# EAGLE design Audio panel board (EAGLE 9.6.2)
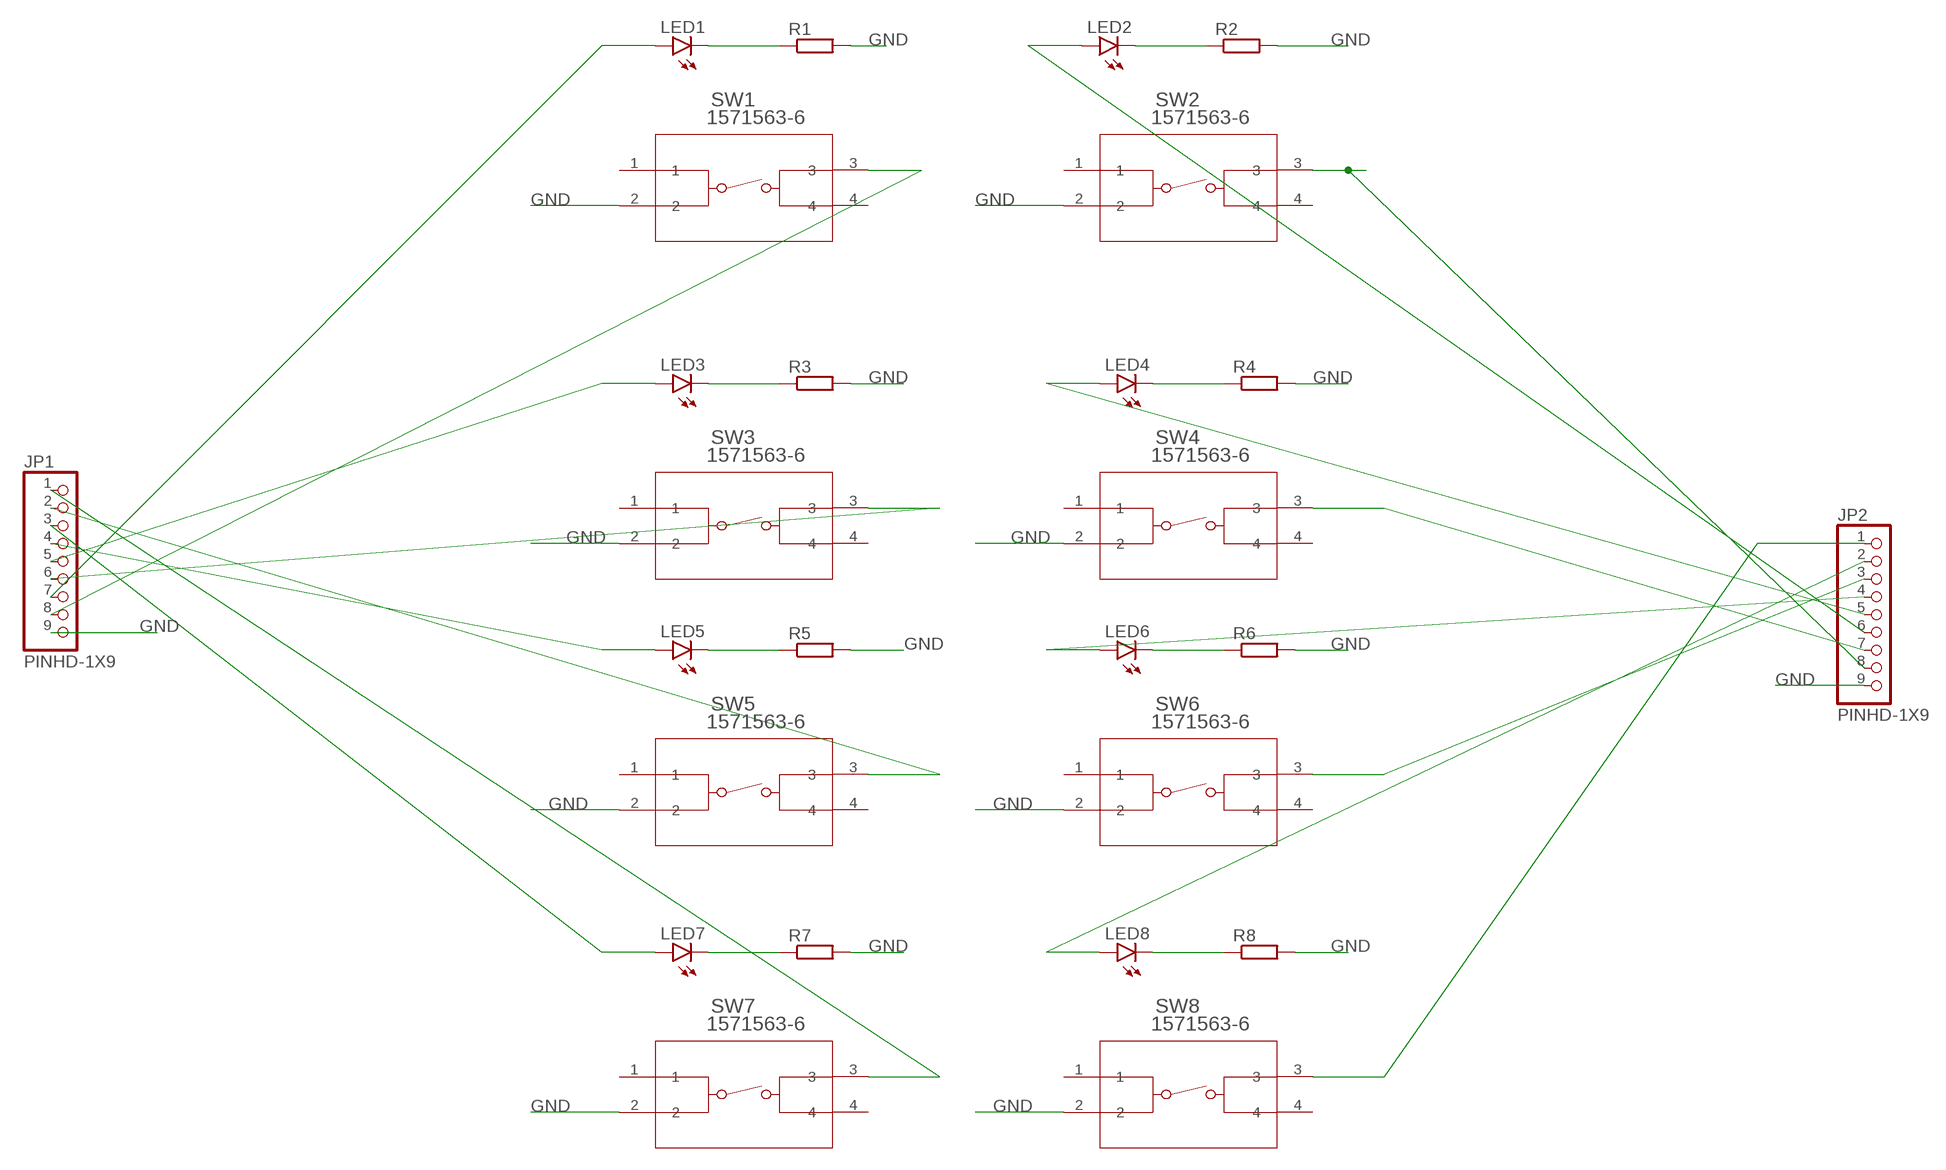
[diagram p0: schematic, sheet 1, part 1 of 2]
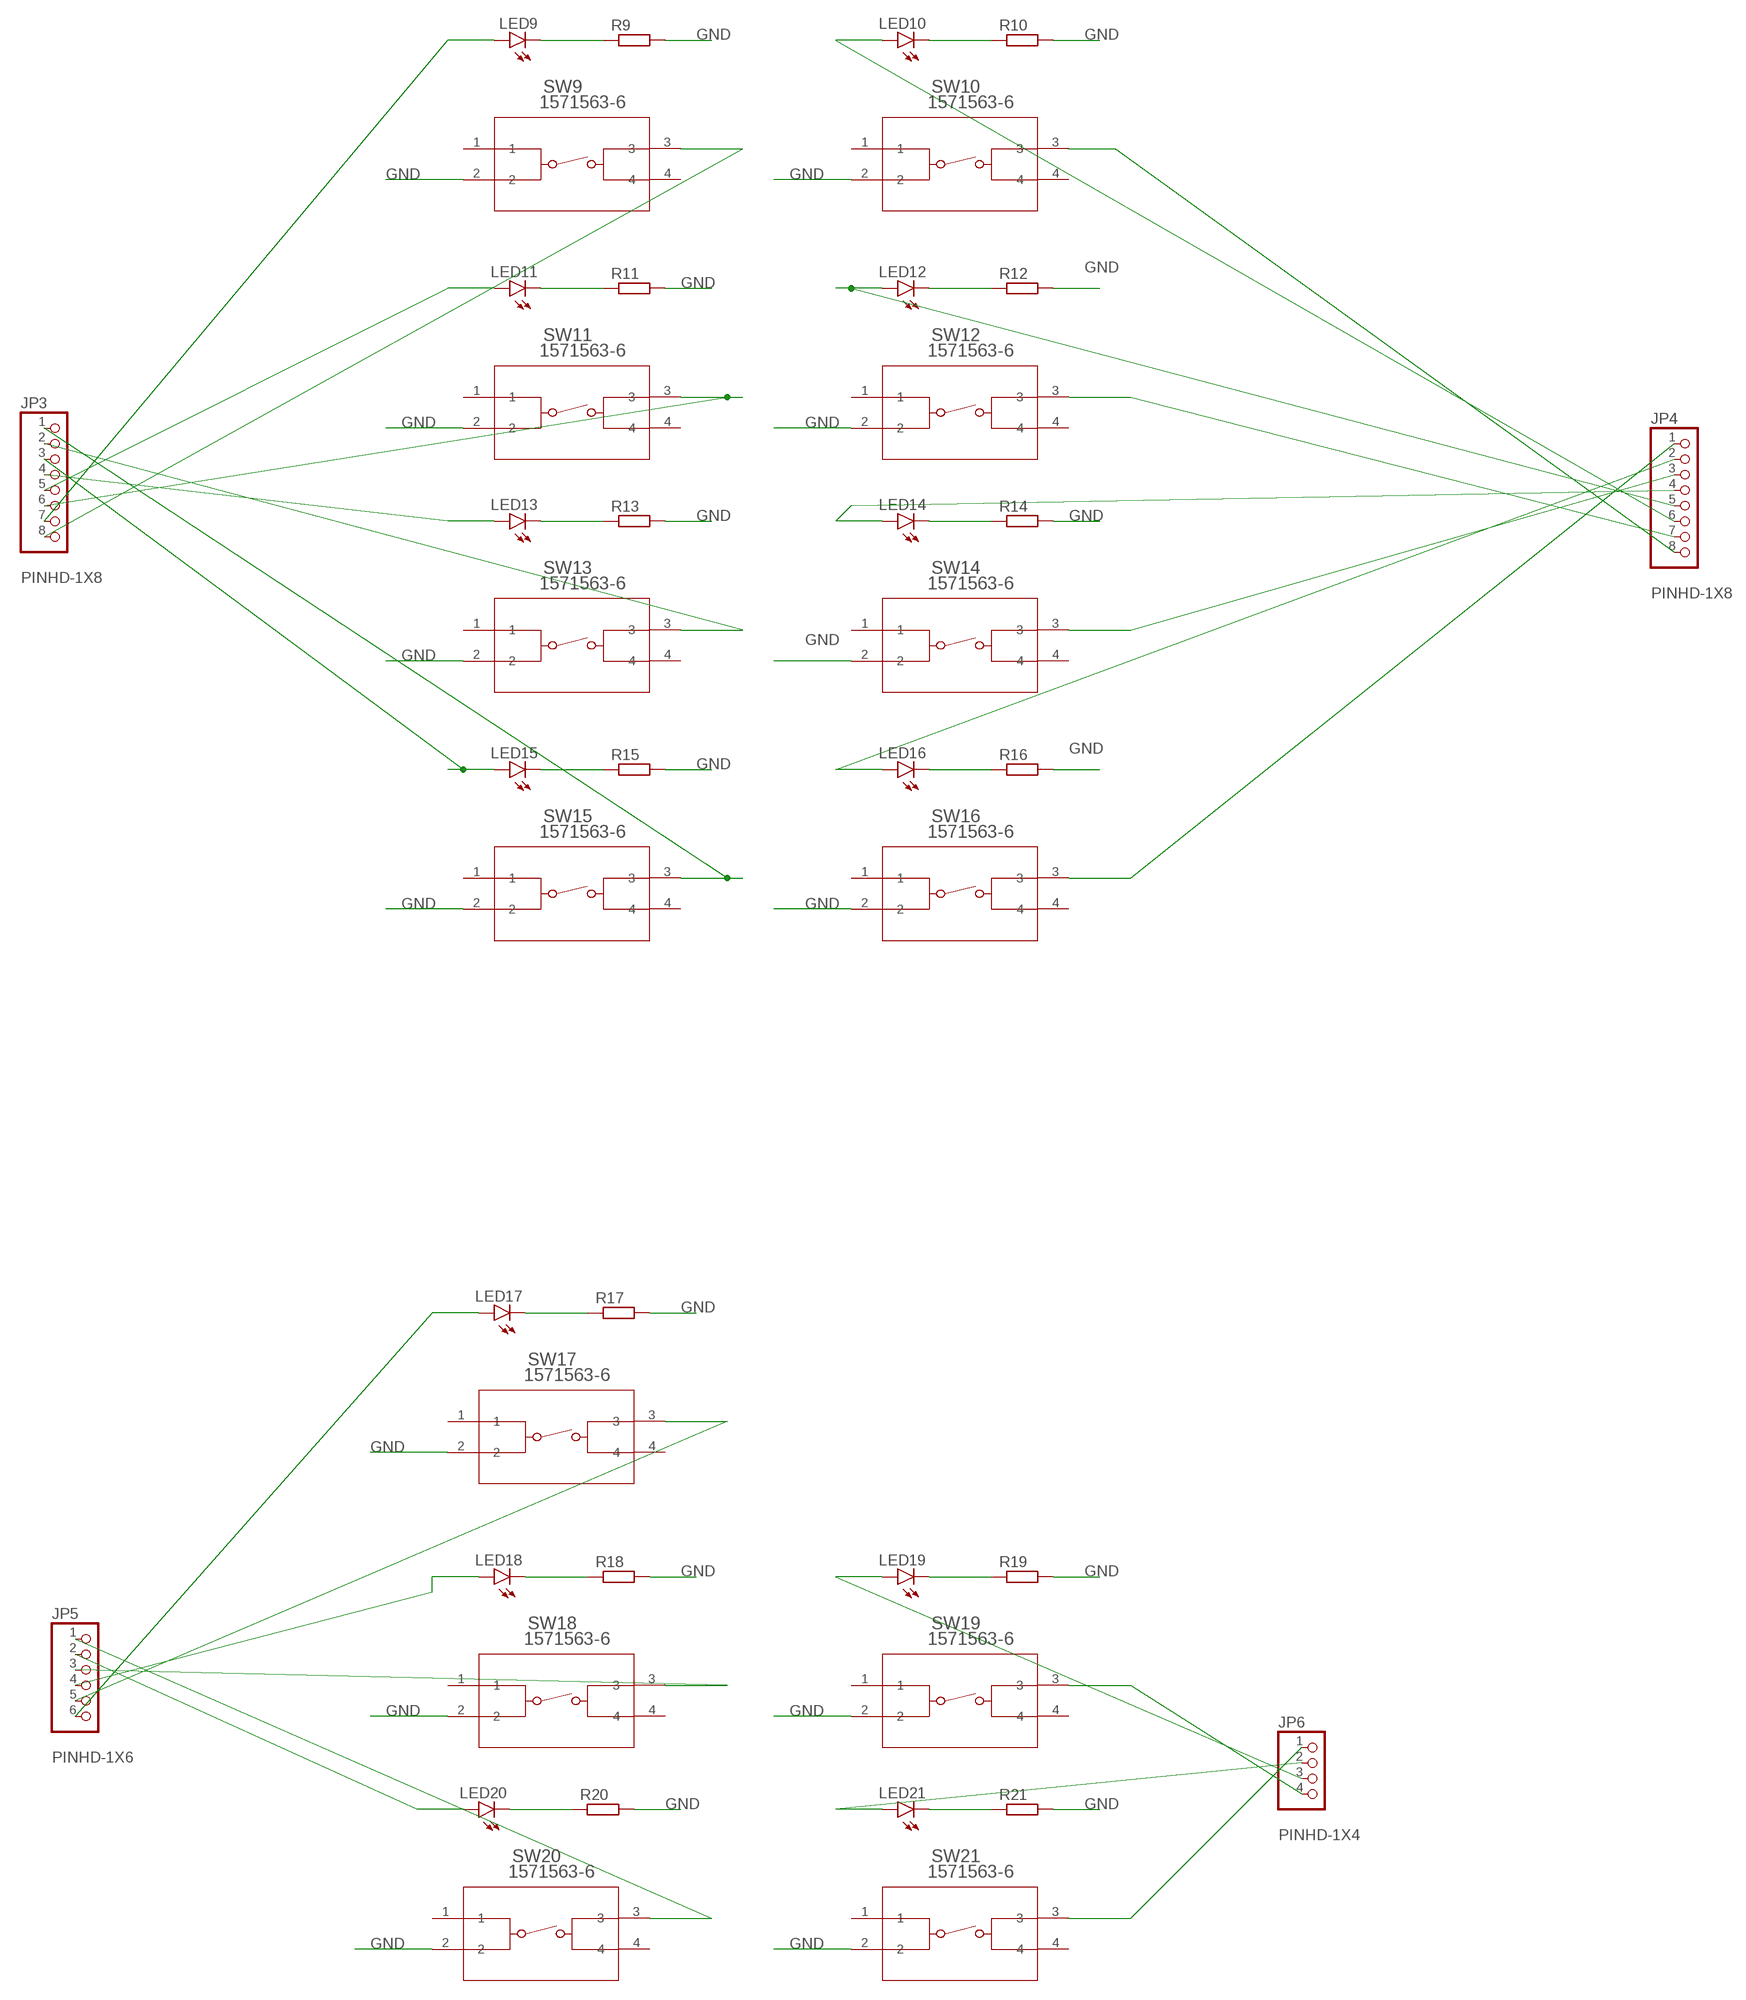
[diagram p1: schematic, sheet 1, part 2 of 2]

## Parts
JP1  PINHD-1X9  [1X09]
JP2  PINHD-1X9  [1X09]
JP3  PINHD-1X8  [1X08]
JP4  PINHD-1X8  [1X08]
JP5  PINHD-1X6  [1X06]
JP6  PINHD-1X4  [1X04]
LED1  LEDCHIP-LED0805  [CHIP-LED0805]
LED2  LEDCHIP-LED0805  [CHIP-LED0805]
LED3  LEDCHIP-LED0805  [CHIP-LED0805]
LED4  LEDCHIP-LED0805  [CHIP-LED0805]
LED5  LEDCHIP-LED0805  [CHIP-LED0805]
LED6  LEDCHIP-LED0805  [CHIP-LED0805]
LED7  LEDCHIP-LED0805  [CHIP-LED0805]
LED8  LEDCHIP-LED0805  [CHIP-LED0805]
LED9  LEDCHIP-LED0805  [CHIP-LED0805]
LED10  LEDCHIP-LED0805  [CHIP-LED0805]
LED11  LEDCHIP-LED0805  [CHIP-LED0805]
LED12  LEDCHIP-LED0805  [CHIP-LED0805]
LED13  LEDCHIP-LED0805  [CHIP-LED0805]
LED14  LEDCHIP-LED0805  [CHIP-LED0805]
LED15  LEDCHIP-LED0805  [CHIP-LED0805]
LED16  LEDCHIP-LED0805  [CHIP-LED0805]
LED17  LEDCHIP-LED0805  [CHIP-LED0805]
LED18  LEDCHIP-LED0805  [CHIP-LED0805]
LED19  LEDCHIP-LED0805  [CHIP-LED0805]
LED20  LEDCHIP-LED0805  [CHIP-LED0805]
LED21  LEDCHIP-LED0805  [CHIP-LED0805]
R1  R-EU_R1206  [R1206]
R2  R-EU_R1206  [R1206]
R3  R-EU_R1206  [R1206]
R4  R-EU_R1206  [R1206]
R5  R-EU_R1206  [R1206]
R6  R-EU_R1206  [R1206]
R7  R-EU_R1206  [R1206]
R8  R-EU_R1206  [R1206]
R9  R-EU_R1206  [R1206]
R10  R-EU_R1206  [R1206]
R11  R-EU_R1206  [R1206]
R12  R-EU_R1206  [R1206]
R13  R-EU_R1206  [R1206]
R14  R-EU_R1206  [R1206]
R15  R-EU_R1206  [R1206]
R16  R-EU_R1206  [R1206]
R17  R-EU_R1206  [R1206]
R18  R-EU_R1206  [R1206]
R19  R-EU_R1206  [R1206]
R20  R-EU_R1206  [R1206]
R21  R-EU_R1206  [R1206]
SW1  1571563-6  [SW4_1437565-E]
SW2  1571563-6  [SW4_1437565-E]
SW3  1571563-6  [SW4_1437565-E]
SW4  1571563-6  [SW4_1437565-E]
SW5  1571563-6  [SW4_1437565-E]
SW6  1571563-6  [SW4_1437565-E]
SW7  1571563-6  [SW4_1437565-E]
SW8  1571563-6  [SW4_1437565-E]
SW9  1571563-6  [SW4_1437565-E]
SW10  1571563-6  [SW4_1437565-E]
SW11  1571563-6  [SW4_1437565-E]
SW12  1571563-6  [SW4_1437565-E]
SW13  1571563-6  [SW4_1437565-E]
SW14  1571563-6  [SW4_1437565-E]
SW15  1571563-6  [SW4_1437565-E]
SW16  1571563-6  [SW4_1437565-E]
SW17  1571563-6  [SW4_1437565-E]
SW18  1571563-6  [SW4_1437565-E]
SW19  1571563-6  [SW4_1437565-E]
SW20  1571563-6  [SW4_1437565-E]
SW21  1571563-6  [SW4_1437565-E]

## Nets
GND: JP1.9 JP2.9 R1.2 R2.2 R3.2 R4.2 R5.2 R6.2 R7.2 R8.2 R9.2 R10.2 R11.2 R12.2 R13.2 R14.2 R15.2 R16.2 R17.2 R18.2 R19.2 R20.2 R21.2 SW1.2 SW2.2 SW3.2 SW4.2 SW5.2 SW6.2 SW7.2 SW8.2 SW9.2 SW10.2 SW11.2 SW12.2 SW13.2 SW14.2 SW15.2 SW16.2 SW17.2 SW18.2 SW19.2 SW20.2 SW21.2
N$1: JP2.1 SW8.3
N$2: JP4.8 SW10.3
N$3: JP5.4 LED18.A
N$4: LED1.C R1.1
N$5: LED2.C R2.1
N$6: LED3.C R3.1
N$10: JP1.7 LED1.A
N$11: JP1.5 LED3.A
N$12: JP2.6 LED2.A
N$13: JP2.8 SW2.3
N$14: JP1.8 SW1.3
N$15: JP1.6 SW3.3
N$17: LED4.C R4.1
N$19: JP2.5 LED4.A
N$20: JP2.7 SW4.3
N$22: LED5.C R5.1
N$24: JP1.4 LED5.A
N$25: JP1.2 SW5.3
N$27: LED6.C R6.1
N$29: JP2.4 LED6.A
N$30: JP2.3 SW6.3
N$32: LED7.C R7.1
N$34: JP1.3 LED7.A
N$35: JP1.1 SW7.3
N$37: LED8.C R8.1
N$39: JP2.2 LED8.A
N$42: LED9.C R9.1
N$44: JP3.7 LED9.A
N$45: JP3.8 SW9.3
N$47: LED10.C R10.1
N$49: JP4.6 LED10.A
N$52: LED11.C R11.1
N$54: JP3.5 LED11.A
N$55: JP3.6 SW11.3
N$57: LED12.C R12.1
N$59: JP4.5 LED12.A
N$60: JP4.7 SW12.3
N$62: LED13.C R13.1
N$64: JP3.4 LED13.A
N$65: JP3.2 SW13.3
N$67: LED14.C R14.1
N$69: JP4.4 LED14.A
N$70: JP4.3 SW14.3
N$72: LED15.C R15.1
N$74: JP3.3 LED15.A
N$75: JP3.1 SW15.3
N$77: LED16.C R16.1
N$79: JP4.2 LED16.A
N$80: JP4.1 SW16.3
N$82: LED17.C R17.1
N$84: JP5.6 LED17.A
N$85: JP5.5 SW17.3
N$87: LED18.C R18.1
N$90: JP5.3 SW18.3
N$92: LED19.C R19.1
N$94: JP6.3 LED19.A
N$95: JP6.4 SW19.3
N$97: LED20.C R20.1
N$99: JP5.2 LED20.A
N$100: JP5.1 SW20.3
N$102: LED21.C R21.1
N$104: JP6.2 LED21.A
N$105: JP6.1 SW21.3
Unconnected: SW1.1 SW1.4 SW2.1 SW2.4 SW3.1 SW3.4 SW4.1 SW4.4 SW5.1 SW5.4 SW6.1 SW6.4 SW7.1 SW7.4 SW8.1 SW8.4 SW9.1 SW9.4 SW10.1 SW10.4 SW11.1 SW11.4 SW12.1 SW12.4 SW13.1 SW13.4 SW14.1 SW14.4 SW15.1 SW15.4 SW16.1 SW16.4 SW17.1 SW17.4 SW18.1 SW18.4 SW19.1 SW19.4 SW20.1 SW20.4 SW21.1 SW21.4

## Library data of the parts
JP1 JP2 = Connector:PINHD-1X9: PIN HEADER; CATEGORY: CONNECTOR; SUB-CATEGORY: PIN-HEADER
JP3 JP4 = Connector:PINHD-1X8: PIN HEADER; CATEGORY: CONNECTOR; SUB-CATEGORY: PIN-HEADER
JP5 = Connector:PINHD-1X6: PIN HEADER; CATEGORY: CONNECTOR; SUB-CATEGORY: PIN-HEADER
JP6 = Connector:PINHD-1X4: PIN HEADER; CATEGORY: CONNECTOR; SUB-CATEGORY: PIN-HEADER
LED1-LED21 = led:LED: LED OSRAM: - CHIPLED LG R971, LG N971, LY N971, LG Q971, LY Q971, LO R971, LY R971 LH N974, LH R974 LS Q976, LO Q976, LY Q976 LO Q996 - Hyper CHIPLED LW Q18S LB Q993, LB Q99A, LB R99A - SideLED LS A670, LO A670, LY A670, LG A670, LP A670 LB A673, LV A673, LT A673, LW A673 LH A674 LY A675 LS A676, LA A676, LO A676, LY A676, LW A676 LS A679, LY A679, LG A679 - Hyper Micro SIDELED® LS Y876, LA Y876, LO Y876, LY Y876 LT Y87S - SmartLED LW L88C, LW L88S LB L89C, LB L89S, LG L890 LS L89K, LO L89K, LY L89K LS L896, LA L896, LO L896, LY L896 - TOPLED LS T670, LO T670, LY T670, LG T670, LP T670 LSG T670, LSP T670, LSY T670, LOP T670, LYG T670 LG T671, LOG T671, LSG T671 LB T673, LV T673, LT T673, LW T673 LH T674 LS T676, LA T676, LO T676, LY T676, LB T676, LH T676, LSB T676, LW T676 LB T67C, LV T67C, LT T67C, LS T67K, LO T67K, LY T67K, LW E67C LS E67B, LA E67B, LO E67B, LY E67B, LB E67C, LV E67C, LT E67C LW T67C LS T679, LY T679, LG T679 LS T770, LO T770, LY T770, LG T770, LP T770 LB T773, LV T773, LT T773, LW T773 LH T774 LS E675, LA E675, LY E675, LS T675 LS T776, LA T776, LO T776, LY T776, LB T776 LHGB T686 LT T68C, LB T68C - Hyper Mini TOPLED® LB M676 - Mini TOPLED Santana® LG M470 LS M47K, LO M47K, LY M47K Source: http://www.osram.convergy.de LUXEON: - LUMILED® LXK2-PW12-R00, LXK2-PW12-S00, LXK2-PW14-U00, LXK2-PW14-V00 LXK2-PM12-R00, LXK2-PM12-S00, LXK2-PM14-U00 LXK2-PE12-Q00, LXK2-PE12-R00, LXK2-PE12-S00, LXK2-PE14-T00, LXK2-PE14-U00 LXK2-PB12-K00, LXK2-PB12-L00, LXK2-PB12-M00, LXK2-PB14-N00, LXK2-PB14-P00, LXK2-PB14-Q00 LXK2-PR12-L00, LXK2-PR12-M00, LXK2-PR14-Q00, LXK2-PR14-R00 LXK2-PD12-Q00, LXK2-PD12-R00, LXK2-PD12-S00 LXK2-PH12-R00, LXK2-PH12-S00 LXK2-PL12-P00, LXK2-PL12-Q00, LXK2-PL12-R00 Source: www.luxeon.com KINGBRIGHT: KA-3528ASYC Source: www.kingbright.com
R1-R21 = rcl:R-EU_: RESISTOR, European symbol; SPICEPREFIX: R
SW1-SW21 = Switches:1571563-6; BUILT_BY: EMA_UL_Team; CATEGORY: Tactile Switches; COPYRIGHT: Copyright (C) 2016 Accelerated Designs. All rights reserved; DESCRIPTION: FSM14JSMAATR=TACT,SMT,T&R; MANUFACTURER_PART_NUMBER: 1571563-6; PART_STATUS: active; SERIES: Alcoswitch FSMJSMA; VENDOR: TE Connectivity

## Board
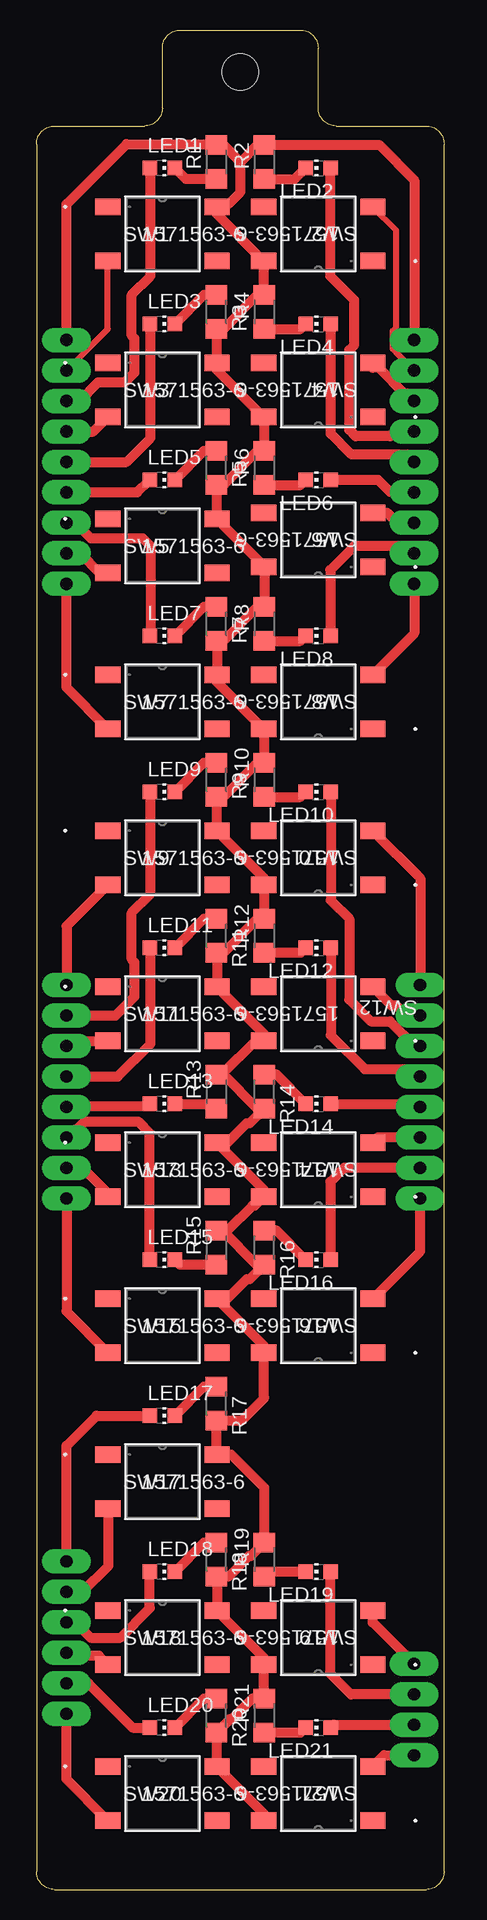
[diagram p2: board, top side]
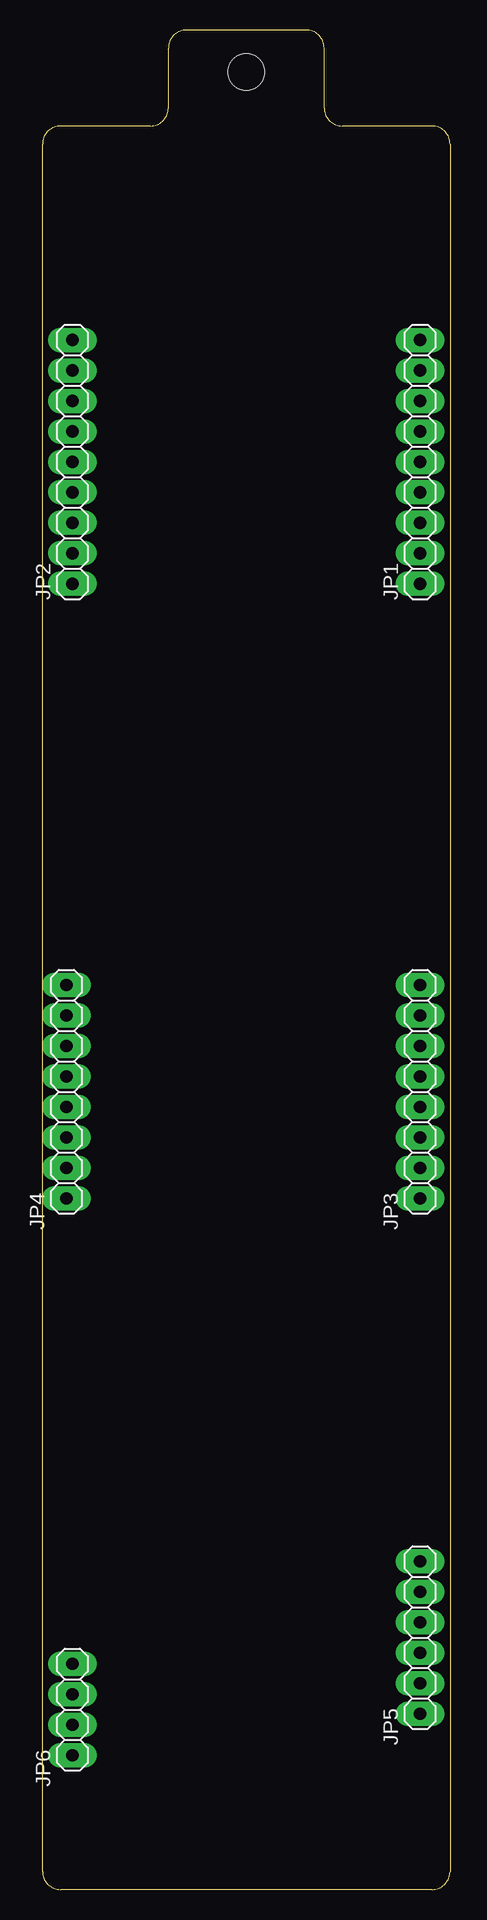
[diagram p3: board, bottom side, seen from below]

Size 34 x 155 mm. Coordinates in mm from the lower left corner, seen from the top.
Outline: 1.5,0 32.5,0 arc90 34,1.5 34,145.5 arc90 32.5,147 25,147 arc-90 23.5,148.5 23.5,153.5 arc90 22,155 12,155 arc90 10.5,153.5 10.5,148.5 arc-90 9,147 1.5,147 arc90 0,145.5 0,1.5 arc90 1.5,0
Copper layers (1*16): Top 0.035mm / dielectric 1.5mm / Bottom 0.035mm
Design rules "swidzi_milling_3018_tht_test": minimum track width 20mil, minimum drill 0.8mm, track to track 20mil, track to pad 20mil, pad to pad 20mil, via to via 6mil, smd to smd 6mil, copper to edge 15mil, drill to drill 6mil, minimum pad ring 10mil, minimum via ring 8mil, stop-mask expansion 4mil, vias tented up to drill 0mil, thermal gap 10mil
Holes 3 mm at 17,151.5

### Footprints (pad centres in the part's own frame; a part is rotated, then mirrored left to right if it is on the bottom)
1X09 = drill 1.016 long: 1 -10.16,0; 2 -7.62,0; 3 -5.08,0; 4 -2.54,0; 5 0,0; 6 2.54,0; 7 5.08,0; 8 7.62,0; 9 10.16,0
1X08 = drill 1.016 long: 1 -8.89,0; 2 -6.35,0; 3 -3.81,0; 4 -1.27,0; 5 1.27,0; 6 3.81,0; 7 6.35,0; 8 8.89,0
1X06 = drill 1.016 long: 1 -6.35,0; 2 -3.81,0; 3 -1.27,0; 4 1.27,0; 5 3.81,0; 6 6.35,0
1X04 = drill 1.016 long: 1 -3.81,0; 2 -1.27,0; 3 1.27,0; 4 3.81,0
CHIP-LED0805 = smd 1.2 x 1.2: A 0,-1.05; C 0,1.05
R1206 = smd 1.6 x 1.803: 1 -1.422,0; 2 1.422,0
SW4_1437565-E = smd 2.108 x 1.397: 1 -4.55,2.25; 2 4.55,2.25; 3 -4.55,-2.25; 4 4.55,-2.25

### Placement (x,y rotation side)
JP1  2.5,119 90 bottom
JP2  31.5,119 90 bottom
JP3  2.5,66.5 90 bottom
JP4  32,66.5 90 bottom
JP5  2.5,21 90 bottom
JP6  31.5,15 90 bottom
LED1  10.5,143.5 270 top
LED2  23.5,143.5 90 top
LED3  10.5,130.5 270 top
LED4  23.5,130.5 90 top
LED5  10.5,117.5 270 top
LED6  23.5,117.5 90 top
LED7  10.5,104.5 270 top
LED8  23.5,104.5 90 top
LED9  10.5,91.5 270 top
LED10  23.5,91.5 90 top
LED11  10.5,78.5 270 top
LED12  23.5,78.5 90 top
LED13  10.5,65.5 270 top
LED14  23.5,65.5 90 top
LED15  10.5,52.5 270 top
LED16  23.5,52.5 90 top
LED17  10.5,39.5 270 top
LED18  10.5,26.5 270 top
LED19  23.5,26.5 90 top
LED20  10.5,13.5 270 top
LED21  23.5,13.5 90 top
R1  15,144 90 top
R2  19,144 90 top
R3  15,131.5 270 top
R4  19,131.5 90 top
R5  15,118.5 270 top
R6  19,118.5 90 top
R7  15,105.5 270 top
R8  19,105.5 90 top
R9  15,92.5 270 top
R10  19,92.5 90 top
R11  15,79.5 270 top
R12  19,79.5 90 top
R13  15,66.5 90 top
R14  19,66.5 270 top
R15  15,53.5 90 top
R16  19,53.5 270 top
R17  15,40.5 270 top
R18  15,27.5 270 top
R19  19,27.5 90 top
R20  15,14.5 270 top
R21  19,14.5 90 top
SW1  10.5,138 0 top
SW2  23.5,138 180 top
SW3  10.5,125 0 top
SW4  23.5,125 180 top
SW5  10.5,112 0 top
SW6  23.5,112.5 180 top
SW7  10.5,99 0 top
SW8  23.5,99 180 top
SW9  10.5,86 0 top
SW10  23.5,86 180 top
SW11  10.5,73 0 top
SW12  23.5,73 180 top
SW13  10.5,60 0 top
SW14  23.5,60 180 top
SW15  10.5,47 0 top
SW16  23.5,47 180 top
SW17  10.5,34 0 top
SW18  10.5,21 0 top
SW19  23.5,21 180 top
SW20  10.5,8 0 top
SW21  23.5,8 180 top

### Tracks (layer width: path | path; a pad name or v marks a point on that pad's centre or on a via)
GND
  Top 0.813: 15.58,130.08 R3.2 | 15.58,130.08 18.42,132.92 R4.2 18.95,132.97 SW2.2 15.05,139.65 SW1.2 15.3,140.5 16,140.5 17,141.5 17,144 | 15.58,130.08 15.05,129.55 SW3.2 15.05,126.65 SW4.2 19,122.7 R6.2 18.42,119.92 15.58,117.08 R5.2 15.05,117.03 SW5.2 18.95,110.35 SW6.2 19,110.2 R8.2 18.42,106.92 15.58,104.08 R7.2 15.05,104.03 SW7.2 15.05,100.65 SW8.2 19,96.7 R10.2 18.42,93.92 15.58,91.08 R9.2 15,88.3 SW9.2 18.95,84.35 SW10.2 19,83.7 R12.2 18.42,80.92 15.58,78.08 R11.2 15.05,78.03 SW11.2 18.95,71.35 SW12.2 18.25,70.75 15.42,67.92 | 15.42,67.92 R13.2 | 15.42,67.92 15.58,67.92 18.42,65.08 R14.2 17.79,63.86 17.52,63.86 15.9,62.25 SW13.2 18.95,58.35 SW14.2 18.2,57 18,57 15.92,54.92 15.5,54.92 | 15.5,54.92 R15.2 | 15.5,54.92 18.34,52.08 R16.2 17.79,50.86 17.52,50.86 15.9,49.25 SW15.2 18.95,45.35 SW16.2 18.95,41.05 19,41 17.08,39.08 R17.2 15,36.3 SW17.2 16.25,36.25 19,33.5 R19.2 17.87,27.79 17.72,27.79 16,26.08 R18.2 15.05,26.03 SW18.2 18.95,19.35 SW19.2 18.95,15.97 R21.2 18,15.92 16.28,14.21 16.13,14.21 R20.2 15,10.3 SW20.2 18.95,6.35 SW21.2 | JP2.9 31.5,142.5 28.58,145.42 R2.2 18.42,145.42 17,144 | 17,144 15.58,145.42 R1.2 14.92,145.5 7.5,145.5 2.5,140.5 JP1.9
N$1
  Top 0.813: JP2.1 31.5,104.7 SW8.3
N$2
  Top 0.813: SW10.3 32,84.3 JP4.8
N$3
  Top 0.813: JP5.4 3.23,22.27 4.5,21 7,21 9.45,23.45 LED18.A
N$4
  Top 0.813: R1.1 12.47,142.58 LED1.C
N$5
  Top 0.813: R2.1 21.53,142.58 LED2.C
N$6
  Top 0.813: LED3.C 13.97,132.92 R3.1
N$10
  Top 0.813: JP1.7 3.58,124.08 5.14,125.64 7.38,125.64 8.18,126.43 8.18,129.28 7.94,129.52 7.94,132.94 9.5,134.5 9.5,143.45 LED1.A
N$11
  Top 0.813: LED3.A 9.5,130.45 9.5,121 7.5,119 JP1.5
N$12
  Top 0.813: JP2.6 29.89,121.54 29.48,121.14 26.62,121.14 26.08,121.67 26.08,128.33 26.5,128.75 26.5,132.5 24.5,134.5 24.5,143.45 LED2.A
N$13
  Top 0.508: JP2.8 30,128.12 30,128.15 29.72,128.42 29.72,129.9 30,130.17 30,138.3 SW2.3
N$14
  Top 0.508: JP1.8 4.13,128.25 4.13,128.26 5.95,130.08 SW1.3
N$15
  Top 0.813: JP1.6 4.74,121.54 SW3.3
N$17
  Top 0.813: R4.1 22.03,130.08 LED4.C
N$19
  Top 0.813: JP2.5 30.89,119.61 26.28,119.61 24.55,121.34 LED4.A
N$20
  Top 0.813: SW4.3 28.05,126.84 28.55,126.84 30.7,124.69 30.89,124.69 JP2.7
N$22
  Top 0.813: LED5.C 13.97,119.92 R5.1
N$24
  Top 0.813: JP1.4 8.41,116.46 LED5.A
N$25
  Top 0.813: JP1.2 3.62,111.38 5.25,109.75 SW5.3
N$27
  Top 0.813: R6.1 22.03,117.08 LED6.C
N$29
  Top 0.813: JP2.4 31.46,116.5 29.5,116.5 28.5,117.5 LED6.A
N$30
  Top 0.813: SW6.3 29.25,114.75 30.08,113.92 JP2.3
N$32
  Top 0.813: LED7.C 13.97,106.92 R7.1
N$34
  Top 0.813: JP1.3 3.23,113.92 4.52,112.64 8.86,112.64 9.5,112 9.5,104.55 LED7.A
N$35
  Top 0.813: SW7.3 2.5,100.2 JP1.1
N$37
  Top 0.813: R8.1 22.03,104.08 LED8.C
N$39
  Top 0.813: JP2.2 30.89,111.99 30.7,111.99 30.69,112 26.5,112 24.5,110 24.5,104.55 LED8.A
N$42
  Top 0.813: LED9.C 13.97,93.92 R9.1
N$44
  Top 0.813: JP3.7 6.6,72.85 8.18,74.43 8.18,77.28 7.94,77.52 7.94,81.44 9.5,83 9.5,91.45 LED9.A
N$45
  Top 0.813: SW9.3 2.5,80.3 JP3.8
N$47
  Top 0.813: R10.1 22.03,91.08 LED10.C
N$49
  Top 0.813: LED10.A 24.55,82.45 26.08,80.92 26.08,74.17 27.89,72.36 29.48,72.36 31.54,70.31 JP4.6
N$52
  Top 0.813: LED11.C 13.97,80.92 R11.1
N$54
  Top 0.813: JP3.5 6.77,67.77 9.5,70.5 9.5,78.45 LED11.A
N$55
  Top 0.813: JP3.6 2.94,70.75 SW11.3
N$57
  Top 0.813: LED12.C 22.03,78.08 R12.1
N$59
  Top 0.813: JP4.5 31.39,68.38 27.38,68.38 24.55,71.2 LED12.A
N$60
  Top 0.813: JP4.7 30.86,72.85 30.03,73.68 29.62,73.68 SW12.3
N$62
  Top 0.813: LED13.C 14.58,65.5 R13.1
N$64
  Top 0.813: JP3.4 3.36,65.23 3.44,65.31 9.26,65.31 LED13.A
N$65
  Top 0.813: JP3.2 2.65,60 4,60 5.95,58.05 SW13.3
N$67
  Top 0.813: LED14.C 20.03,67.92 R14.1
N$69
  Top 0.813: LED14.A 31.73,65.5 JP4.4
N$70
  Top 0.813: JP4.3 28.49,62.69 SW14.3
N$72
  Top 0.813: R15.1 11.97,52.08 LED15.C
N$74
  Top 0.813: LED15.A 9.45,63.04 8.5,63.99 3.99,63.99 3.3,63.3 3.11,63.3 JP3.3
N$75
  Top 0.813: JP3.1 2.5,48.2 SW15.3
N$77
  Top 0.813: LED16.C 20.03,54.92 R16.1
N$79
  Top 0.813: JP4.2 25.65,60.15 24.5,59 24.5,52.55 LED16.A
N$80
  Top 0.813: SW16.3 32,53.2 JP4.1
N$82
  Top 0.813: LED17.C 13.97,41.92 R17.1
N$84
  Top 0.813: JP5.6 2.5,37 5,39.5 LED17.A
N$85
  Top 0.813: JP5.5 3.81,24.81 6,27 6,31.7 SW17.3
N$87
  Top 0.813: LED18.C 13.97,28.92 R18.1
N$90
  Top 0.813: SW18.3 5.2,19.5 2.73,19.5 JP5.3
N$92
  Top 0.813: LED19.C 19.42,26.5 R19.1
N$94
  Top 0.813: JP6.3 26.23,16.27 24.5,18 24.5,26.45 LED19.A
N$95
  Top 0.813: JP6.4 28.05,22.26 SW19.3
N$97
  Top 0.813: LED20.C 13.97,15.92 R20.1
N$99
  Top 0.813: JP5.2 4.31,17.19 8,13.5 LED20.A
N$100
  Top 0.813: SW20.3 2.5,9.2 JP5.1
N$102
  Top 0.813: LED21.C 22.03,13.08 R21.1
N$104
  Top 0.813: LED21.A 24.78,13.73 JP6.2
N$105
  Top 0.813: SW21.3 28.99,11.19 JP6.1